# Altium schematic sheet Sheet1.SchDoc
size A; SheetNumber: 1; SheetTotal: 1
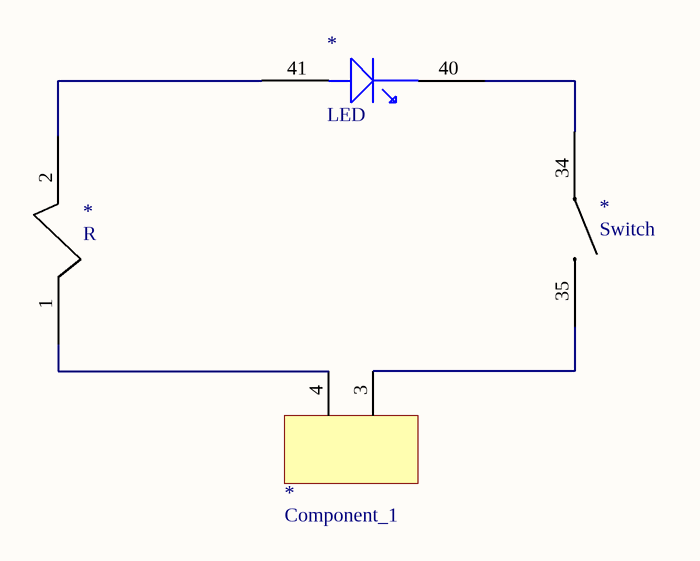
[diagram p0: Sheet1.SchDoc]

## Parts
(Parts that share a designator on the sheet are numbered #1, #2 ... from top to bottom, then left to right.)
*#1  LED  [LED]
*#2  R  [Resistor0603]
*#3  Switch  [Swicth]
*#4  Component_1  [Connector]

## Nets
Net*#1_40: *#1.40 *#3.34
Net*#1_41: *#1.41 *#2.2
Net*#2_1: *#2.1 *#4.4
Net*#3_35: *#3.35 *#4.3